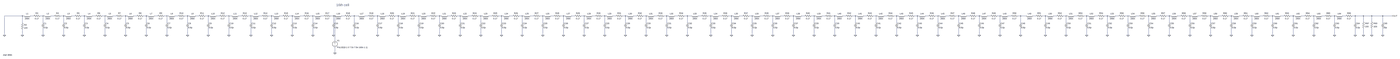
[diagram p0: schematic 64 cell_inject cell 16.asc, whole sheet]
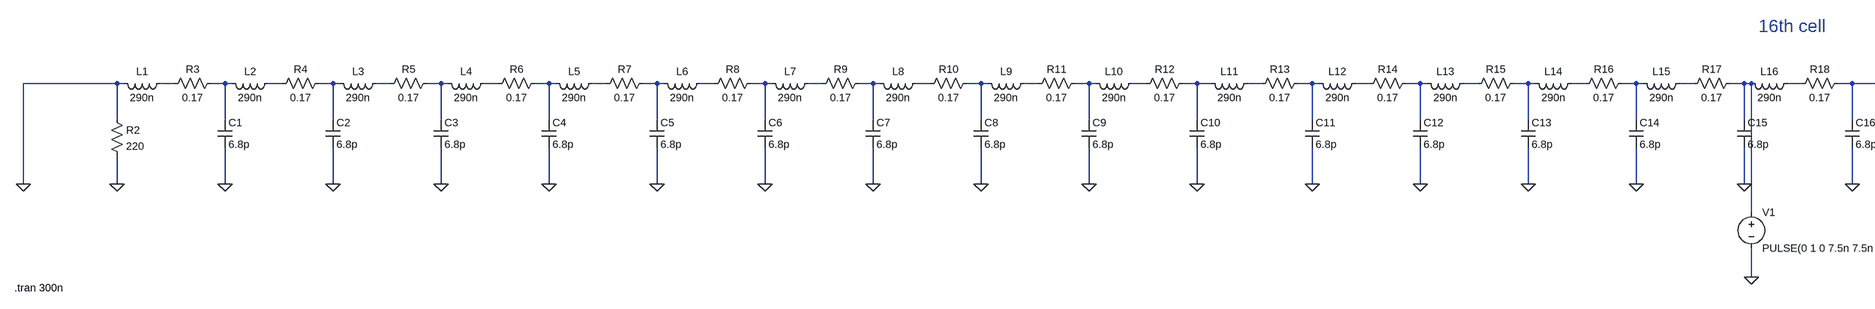
[diagram p1: schematic 64 cell_inject cell 16.asc, part, row 1 of 1, column 1 of 4]
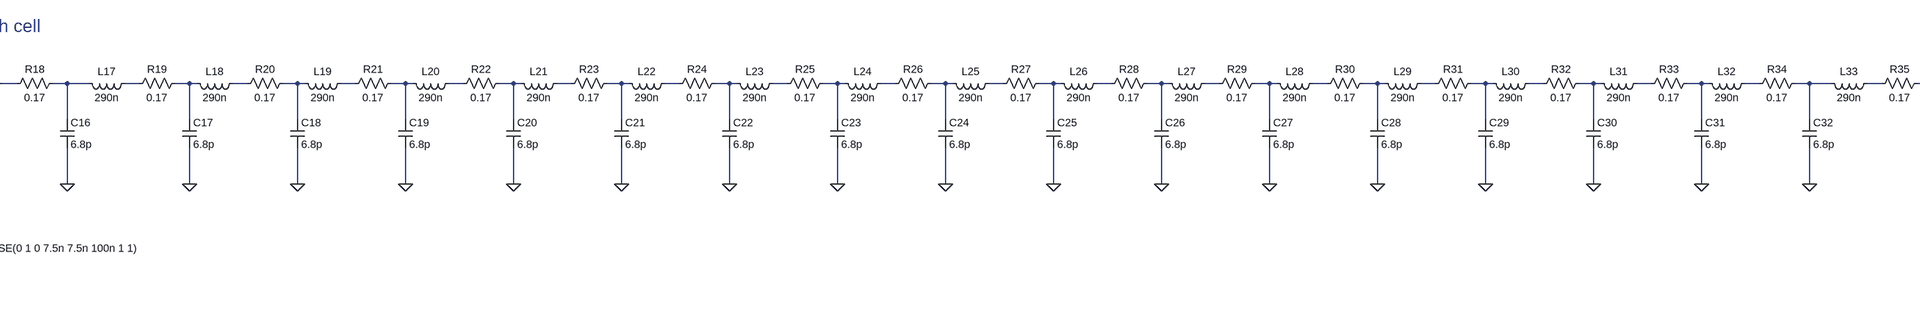
[diagram p2: schematic 64 cell_inject cell 16.asc, part, row 1 of 1, column 2 of 4]
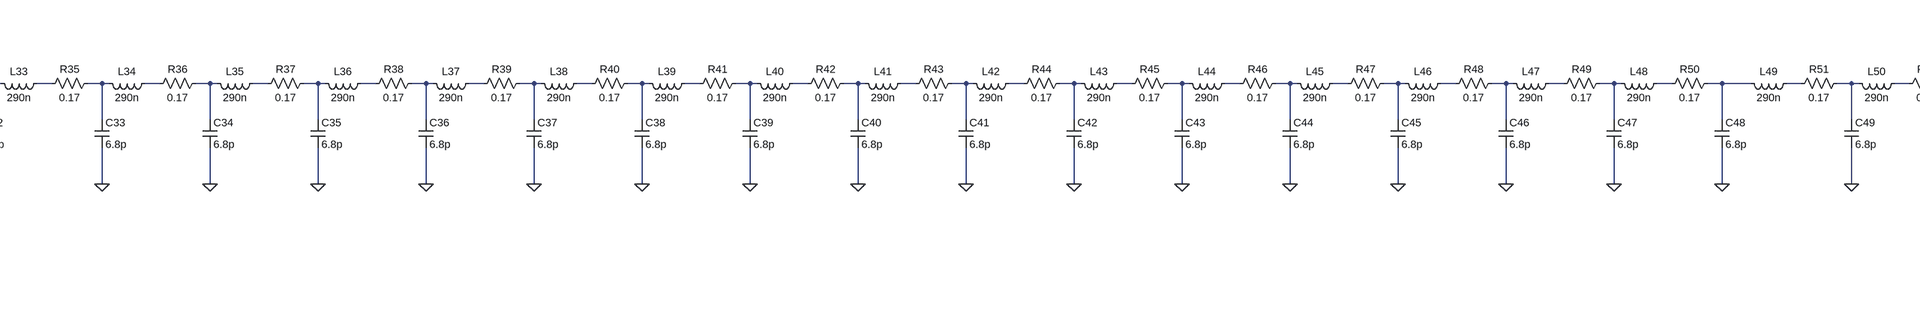
[diagram p3: schematic 64 cell_inject cell 16.asc, part, row 1 of 1, column 3 of 4]
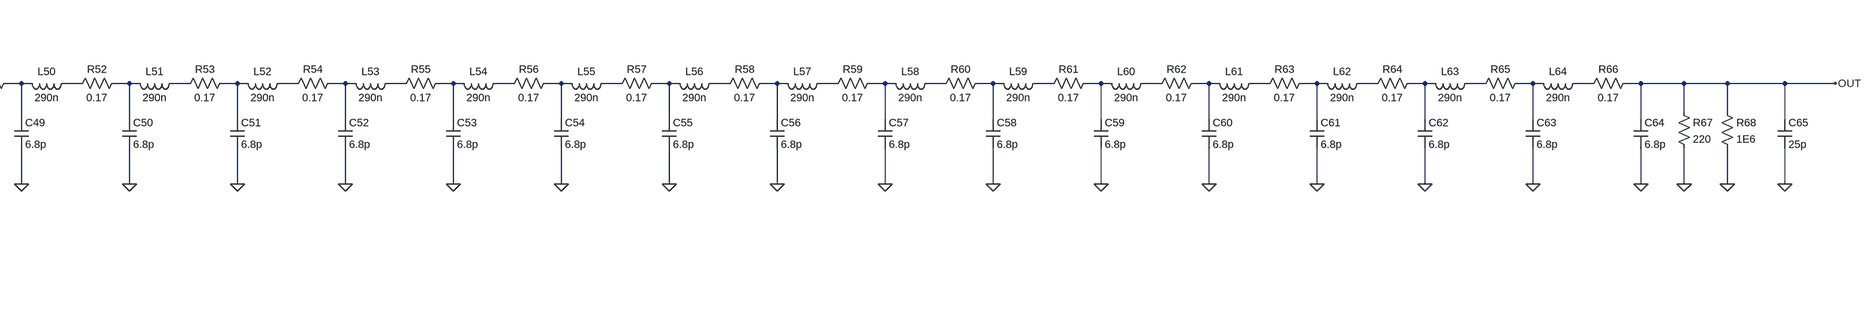
[diagram p4: schematic 64 cell_inject cell 16.asc, part, row 1 of 1, column 4 of 4]
64 cell_inject cell 16.asc, the LTspice schematic file:
Version 4
SHEET 1 8100 680
WIRE -7888 32 -8256 32
WIRE -7872 32 -7888 32
WIRE -7760 32 -7792 32
WIRE -7648 32 -7680 32
WIRE -7632 32 -7648 32
WIRE -7520 32 -7552 32
WIRE -7408 32 -7440 32
WIRE -7392 32 -7408 32
WIRE -7280 32 -7312 32
WIRE -7168 32 -7200 32
WIRE -7152 32 -7168 32
WIRE -7040 32 -7072 32
WIRE -6928 32 -6960 32
WIRE -6912 32 -6928 32
WIRE -6800 32 -6832 32
WIRE -6688 32 -6720 32
WIRE -6672 32 -6688 32
WIRE -6560 32 -6592 32
WIRE -6448 32 -6480 32
WIRE -6432 32 -6448 32
WIRE -6320 32 -6352 32
WIRE -6208 32 -6240 32
WIRE -6192 32 -6208 32
WIRE -6080 32 -6112 32
WIRE -5968 32 -6000 32
WIRE -5952 32 -5968 32
WIRE -5840 32 -5872 32
WIRE -5728 32 -5760 32
WIRE -5712 32 -5728 32
WIRE -5600 32 -5632 32
WIRE -5488 32 -5520 32
WIRE -5456 32 -5488 32
WIRE -5344 32 -5376 32
WIRE -5232 32 -5264 32
WIRE -5216 32 -5232 32
WIRE -5104 32 -5136 32
WIRE -4992 32 -5024 32
WIRE -4976 32 -4992 32
WIRE -4864 32 -4896 32
WIRE -4752 32 -4784 32
WIRE -4736 32 -4752 32
WIRE -4624 32 -4656 32
WIRE -4512 32 -4544 32
WIRE -4496 32 -4512 32
WIRE -4384 32 -4416 32
WIRE -4272 32 -4304 32
WIRE -4256 32 -4272 32
WIRE -4144 32 -4176 32
WIRE -4032 32 -4064 32
WIRE -3984 32 -4032 32
WIRE -3872 32 -3904 32
WIRE -3760 32 -3792 32
WIRE -3744 32 -3760 32
WIRE -3632 32 -3664 32
WIRE -3520 32 -3552 32
WIRE -3504 32 -3520 32
WIRE -3392 32 -3424 32
WIRE -3280 32 -3312 32
WIRE -3264 32 -3280 32
WIRE -3152 32 -3184 32
WIRE -3040 32 -3072 32
WIRE -3024 32 -3040 32
WIRE -2912 32 -2944 32
WIRE -2800 32 -2832 32
WIRE -2784 32 -2800 32
WIRE -2672 32 -2704 32
WIRE -2560 32 -2592 32
WIRE -2544 32 -2560 32
WIRE -2432 32 -2464 32
WIRE -2320 32 -2352 32
WIRE -2304 32 -2320 32
WIRE -2192 32 -2224 32
WIRE -2080 32 -2112 32
WIRE -2064 32 -2080 32
WIRE -1952 32 -1984 32
WIRE -1840 32 -1872 32
WIRE -1824 32 -1840 32
WIRE -1712 32 -1744 32
WIRE -1600 32 -1632 32
WIRE -1584 32 -1600 32
WIRE -1472 32 -1504 32
WIRE -1360 32 -1392 32
WIRE -1344 32 -1360 32
WIRE -1232 32 -1264 32
WIRE -1120 32 -1152 32
WIRE -1104 32 -1120 32
WIRE -992 32 -1024 32
WIRE -880 32 -912 32
WIRE -864 32 -880 32
WIRE -752 32 -784 32
WIRE -640 32 -672 32
WIRE -624 32 -640 32
WIRE -512 32 -544 32
WIRE -400 32 -432 32
WIRE -384 32 -400 32
WIRE -272 32 -304 32
WIRE -160 32 -192 32
WIRE -112 32 -160 32
WIRE 0 32 -32 32
WIRE 112 32 80 32
WIRE 128 32 112 32
WIRE 240 32 208 32
WIRE 352 32 320 32
WIRE 368 32 352 32
WIRE 480 32 448 32
WIRE 592 32 560 32
WIRE 608 32 592 32
WIRE 720 32 688 32
WIRE 832 32 800 32
WIRE 848 32 832 32
WIRE 960 32 928 32
WIRE 1072 32 1040 32
WIRE 1088 32 1072 32
WIRE 1200 32 1168 32
WIRE 1312 32 1280 32
WIRE 1328 32 1312 32
WIRE 1440 32 1408 32
WIRE 1552 32 1520 32
WIRE 1568 32 1552 32
WIRE 1680 32 1648 32
WIRE 1792 32 1760 32
WIRE 1808 32 1792 32
WIRE 1920 32 1888 32
WIRE 2032 32 2000 32
WIRE 2048 32 2032 32
WIRE 2160 32 2128 32
WIRE 2272 32 2240 32
WIRE 2288 32 2272 32
WIRE 2400 32 2368 32
WIRE 2512 32 2480 32
WIRE 2528 32 2512 32
WIRE 2640 32 2608 32
WIRE 2752 32 2720 32
WIRE 2768 32 2752 32
WIRE 2880 32 2848 32
WIRE 2992 32 2960 32
WIRE 3008 32 2992 32
WIRE 3120 32 3088 32
WIRE 3232 32 3200 32
WIRE 3248 32 3232 32
WIRE 3360 32 3328 32
WIRE 3472 32 3440 32
WIRE 3488 32 3472 32
WIRE 3600 32 3568 32
WIRE 3712 32 3680 32
WIRE 3776 32 3712 32
WIRE 3888 32 3856 32
WIRE 4000 32 3968 32
WIRE 4016 32 4000 32
WIRE 4128 32 4096 32
WIRE 4240 32 4208 32
WIRE 4256 32 4240 32
WIRE 4368 32 4336 32
WIRE 4480 32 4448 32
WIRE 4496 32 4480 32
WIRE 4608 32 4576 32
WIRE 4720 32 4688 32
WIRE 4736 32 4720 32
WIRE 4848 32 4816 32
WIRE 4960 32 4928 32
WIRE 4976 32 4960 32
WIRE 5088 32 5056 32
WIRE 5200 32 5168 32
WIRE 5216 32 5200 32
WIRE 5328 32 5296 32
WIRE 5440 32 5408 32
WIRE 5456 32 5440 32
WIRE 5568 32 5536 32
WIRE 5680 32 5648 32
WIRE 5696 32 5680 32
WIRE 5808 32 5776 32
WIRE 5920 32 5888 32
WIRE 5936 32 5920 32
WIRE 6048 32 6016 32
WIRE 6160 32 6128 32
WIRE 6176 32 6160 32
WIRE 6288 32 6256 32
WIRE 6400 32 6368 32
WIRE 6416 32 6400 32
WIRE 6528 32 6496 32
WIRE 6640 32 6608 32
WIRE 6656 32 6640 32
WIRE 6768 32 6736 32
WIRE 6880 32 6848 32
WIRE 6896 32 6880 32
WIRE 7008 32 6976 32
WIRE 7120 32 7088 32
WIRE 7136 32 7120 32
WIRE 7248 32 7216 32
WIRE 7360 32 7328 32
WIRE 7376 32 7360 32
WIRE 7488 32 7456 32
WIRE 7600 32 7568 32
WIRE 7696 32 7600 32
WIRE 7792 32 7696 32
WIRE 7920 32 7792 32
WIRE 8032 32 7920 32
WIRE 7696 96 7696 32
WIRE 7792 96 7792 32
WIRE -7888 112 -7888 32
WIRE -7648 112 -7648 32
WIRE -7408 112 -7408 32
WIRE -7168 112 -7168 32
WIRE -6928 112 -6928 32
WIRE -6688 112 -6688 32
WIRE -6448 112 -6448 32
WIRE -6208 112 -6208 32
WIRE -5968 112 -5968 32
WIRE -5728 112 -5728 32
WIRE -5488 112 -5488 32
WIRE -5232 112 -5232 32
WIRE -4992 112 -4992 32
WIRE -4752 112 -4752 32
WIRE -4512 112 -4512 32
WIRE -4272 112 -4272 32
WIRE -4032 112 -4032 32
WIRE -3760 112 -3760 32
WIRE -3520 112 -3520 32
WIRE -3280 112 -3280 32
WIRE -3040 112 -3040 32
WIRE -2800 112 -2800 32
WIRE -2560 112 -2560 32
WIRE -2320 112 -2320 32
WIRE -2080 112 -2080 32
WIRE -1840 112 -1840 32
WIRE -1600 112 -1600 32
WIRE -1360 112 -1360 32
WIRE -1120 112 -1120 32
WIRE -880 112 -880 32
WIRE -640 112 -640 32
WIRE -400 112 -400 32
WIRE -160 112 -160 32
WIRE 112 112 112 32
WIRE 352 112 352 32
WIRE 592 112 592 32
WIRE 832 112 832 32
WIRE 1072 112 1072 32
WIRE 1312 112 1312 32
WIRE 1552 112 1552 32
WIRE 1792 112 1792 32
WIRE 2032 112 2032 32
WIRE 2272 112 2272 32
WIRE 2512 112 2512 32
WIRE 2752 112 2752 32
WIRE 2992 112 2992 32
WIRE 3232 112 3232 32
WIRE 3472 112 3472 32
WIRE 3712 112 3712 32
WIRE 4000 112 4000 32
WIRE 4240 112 4240 32
WIRE 4480 112 4480 32
WIRE 4720 112 4720 32
WIRE 4960 112 4960 32
WIRE 5200 112 5200 32
WIRE 5440 112 5440 32
WIRE 5680 112 5680 32
WIRE 5920 112 5920 32
WIRE 6160 112 6160 32
WIRE 6400 112 6400 32
WIRE 6640 112 6640 32
WIRE 6880 112 6880 32
WIRE 7120 112 7120 32
WIRE 7360 112 7360 32
WIRE 7600 112 7600 32
WIRE 7920 112 7920 32
WIRE -8256 256 -8256 32
WIRE -7888 256 -7888 192
WIRE -7648 256 -7648 176
WIRE -7408 256 -7408 176
WIRE -7168 256 -7168 176
WIRE -6928 256 -6928 176
WIRE -6688 256 -6688 176
WIRE -6448 256 -6448 176
WIRE -6208 256 -6208 176
WIRE -5968 256 -5968 176
WIRE -5728 256 -5728 176
WIRE -5488 256 -5488 176
WIRE -5232 256 -5232 176
WIRE -4992 256 -4992 176
WIRE -4752 256 -4752 176
WIRE -4512 256 -4512 176
WIRE -4272 256 -4272 176
WIRE -4032 256 -4032 176
WIRE -3760 256 -3760 176
WIRE -3520 256 -3520 176
WIRE -3280 256 -3280 176
WIRE -3040 256 -3040 176
WIRE -2800 256 -2800 176
WIRE -2560 256 -2560 176
WIRE -2320 256 -2320 176
WIRE -2080 256 -2080 176
WIRE -1840 256 -1840 176
WIRE -1600 256 -1600 176
WIRE -1360 256 -1360 176
WIRE -1120 256 -1120 176
WIRE -880 256 -880 176
WIRE -640 256 -640 176
WIRE -400 256 -400 176
WIRE -160 256 -160 176
WIRE 112 256 112 176
WIRE 352 256 352 176
WIRE 592 256 592 176
WIRE 832 256 832 176
WIRE 1072 256 1072 176
WIRE 1312 256 1312 176
WIRE 1552 256 1552 176
WIRE 1792 256 1792 176
WIRE 2032 256 2032 176
WIRE 2272 256 2272 176
WIRE 2512 256 2512 176
WIRE 2752 256 2752 176
WIRE 2992 256 2992 176
WIRE 3232 256 3232 176
WIRE 3472 256 3472 176
WIRE 3712 256 3712 176
WIRE 4000 256 4000 176
WIRE 4240 256 4240 176
WIRE 4480 256 4480 176
WIRE 4720 256 4720 176
WIRE 4960 256 4960 176
WIRE 5200 256 5200 176
WIRE 5440 256 5440 176
WIRE 5680 256 5680 176
WIRE 5920 256 5920 176
WIRE 6160 256 6160 176
WIRE 6400 256 6400 176
WIRE 6640 256 6640 176
WIRE 6880 256 6880 176
WIRE 7120 256 7120 176
WIRE 7360 256 7360 176
WIRE 7600 256 7600 176
WIRE 7696 256 7696 176
WIRE 7792 256 7792 176
WIRE 7920 256 7920 176
WIRE -4256 320 -4256 32
WIRE -4256 464 -4256 400
FLAG -8256 256 0
FLAG -7888 256 0
FLAG -7648 256 0
FLAG -7408 256 0
FLAG -7168 256 0
FLAG -6928 256 0
FLAG -6688 256 0
FLAG -6448 256 0
FLAG -6208 256 0
FLAG -5968 256 0
FLAG -5728 256 0
FLAG -5488 256 0
FLAG -5232 256 0
FLAG -4992 256 0
FLAG -4752 256 0
FLAG -4512 256 0
FLAG -4272 256 0
FLAG -4032 256 0
FLAG -3760 256 0
FLAG -3520 256 0
FLAG -3280 256 0
FLAG -3040 256 0
FLAG -2800 256 0
FLAG -2560 256 0
FLAG -2320 256 0
FLAG -2080 256 0
FLAG -1840 256 0
FLAG -1600 256 0
FLAG -1360 256 0
FLAG -1120 256 0
FLAG -880 256 0
FLAG -640 256 0
FLAG -400 256 0
FLAG -160 256 0
FLAG 112 256 0
FLAG 352 256 0
FLAG 592 256 0
FLAG 832 256 0
FLAG 1072 256 0
FLAG 1312 256 0
FLAG 1552 256 0
FLAG 1792 256 0
FLAG 2032 256 0
FLAG 2272 256 0
FLAG 2512 256 0
FLAG 2752 256 0
FLAG 2992 256 0
FLAG 3232 256 0
FLAG 3472 256 0
FLAG 3712 256 0
FLAG 4000 256 0
FLAG 4240 256 0
FLAG 4480 256 0
FLAG 4720 256 0
FLAG 4960 256 0
FLAG 5200 256 0
FLAG 5440 256 0
FLAG 5680 256 0
FLAG 5920 256 0
FLAG 6160 256 0
FLAG 6400 256 0
FLAG 6640 256 0
FLAG 6880 256 0
FLAG 7120 256 0
FLAG 7360 256 0
FLAG 7600 256 0
FLAG 7696 256 0
FLAG 7792 256 0
FLAG 7920 256 0
FLAG 8032 32 OUT
FLAG -4256 464 0
SYMBOL res -7904 96 R0
SYMATTR InstName R2
SYMATTR Value 220
SYMBOL ind -7776 16 R90
WINDOW 0 5 56 VBottom 2
WINDOW 3 32 56 VTop 2
SYMATTR InstName L1
SYMATTR Value 290n
SYMBOL res -7664 16 R90
WINDOW 0 0 56 VBottom 2
WINDOW 3 32 56 VTop 2
SYMATTR InstName R3
SYMATTR Value 0.17
SYMBOL cap -7664 112 R0
SYMATTR InstName C1
SYMATTR Value 6.8p
SYMBOL ind -7536 16 R90
WINDOW 0 5 56 VBottom 2
WINDOW 3 32 56 VTop 2
SYMATTR InstName L2
SYMATTR Value 290n
SYMBOL res -7424 16 R90
WINDOW 0 0 56 VBottom 2
WINDOW 3 32 56 VTop 2
SYMATTR InstName R4
SYMATTR Value 0.17
SYMBOL cap -7424 112 R0
SYMATTR InstName C2
SYMATTR Value 6.8p
SYMBOL ind -7296 16 R90
WINDOW 0 5 56 VBottom 2
WINDOW 3 32 56 VTop 2
SYMATTR InstName L3
SYMATTR Value 290n
SYMBOL res -7184 16 R90
WINDOW 0 0 56 VBottom 2
WINDOW 3 32 56 VTop 2
SYMATTR InstName R5
SYMATTR Value 0.17
SYMBOL cap -7184 112 R0
SYMATTR InstName C3
SYMATTR Value 6.8p
SYMBOL ind -7056 16 R90
WINDOW 0 5 56 VBottom 2
WINDOW 3 32 56 VTop 2
SYMATTR InstName L4
SYMATTR Value 290n
SYMBOL res -6944 16 R90
WINDOW 0 0 56 VBottom 2
WINDOW 3 32 56 VTop 2
SYMATTR InstName R6
SYMATTR Value 0.17
SYMBOL cap -6944 112 R0
SYMATTR InstName C4
SYMATTR Value 6.8p
SYMBOL ind -6816 16 R90
WINDOW 0 5 56 VBottom 2
WINDOW 3 32 56 VTop 2
SYMATTR InstName L5
SYMATTR Value 290n
SYMBOL res -6704 16 R90
WINDOW 0 0 56 VBottom 2
WINDOW 3 32 56 VTop 2
SYMATTR InstName R7
SYMATTR Value 0.17
SYMBOL cap -6704 112 R0
SYMATTR InstName C5
SYMATTR Value 6.8p
SYMBOL ind -6576 16 R90
WINDOW 0 5 56 VBottom 2
WINDOW 3 32 56 VTop 2
SYMATTR InstName L6
SYMATTR Value 290n
SYMBOL res -6464 16 R90
WINDOW 0 0 56 VBottom 2
WINDOW 3 32 56 VTop 2
SYMATTR InstName R8
SYMATTR Value 0.17
SYMBOL cap -6464 112 R0
SYMATTR InstName C6
SYMATTR Value 6.8p
SYMBOL ind -6336 16 R90
WINDOW 0 5 56 VBottom 2
WINDOW 3 32 56 VTop 2
SYMATTR InstName L7
SYMATTR Value 290n
SYMBOL res -6224 16 R90
WINDOW 0 0 56 VBottom 2
WINDOW 3 32 56 VTop 2
SYMATTR InstName R9
SYMATTR Value 0.17
SYMBOL cap -6224 112 R0
SYMATTR InstName C7
SYMATTR Value 6.8p
SYMBOL ind -6096 16 R90
WINDOW 0 5 56 VBottom 2
WINDOW 3 32 56 VTop 2
SYMATTR InstName L8
SYMATTR Value 290n
SYMBOL res -5984 16 R90
WINDOW 0 0 56 VBottom 2
WINDOW 3 32 56 VTop 2
SYMATTR InstName R10
SYMATTR Value 0.17
SYMBOL cap -5984 112 R0
SYMATTR InstName C8
SYMATTR Value 6.8p
SYMBOL ind -5856 16 R90
WINDOW 0 5 56 VBottom 2
WINDOW 3 32 56 VTop 2
SYMATTR InstName L9
SYMATTR Value 290n
SYMBOL res -5744 16 R90
WINDOW 0 0 56 VBottom 2
WINDOW 3 32 56 VTop 2
SYMATTR InstName R11
SYMATTR Value 0.17
SYMBOL cap -5744 112 R0
SYMATTR InstName C9
SYMATTR Value 6.8p
SYMBOL ind -5616 16 R90
WINDOW 0 5 56 VBottom 2
WINDOW 3 32 56 VTop 2
SYMATTR InstName L10
SYMATTR Value 290n
SYMBOL res -5504 16 R90
WINDOW 0 0 56 VBottom 2
WINDOW 3 32 56 VTop 2
SYMATTR InstName R12
SYMATTR Value 0.17
SYMBOL cap -5504 112 R0
SYMATTR InstName C10
SYMATTR Value 6.8p
SYMBOL ind -5360 16 R90
WINDOW 0 5 56 VBottom 2
WINDOW 3 32 56 VTop 2
SYMATTR InstName L11
SYMATTR Value 290n
SYMBOL res -5248 16 R90
WINDOW 0 0 56 VBottom 2
WINDOW 3 32 56 VTop 2
SYMATTR InstName R13
SYMATTR Value 0.17
SYMBOL cap -5248 112 R0
SYMATTR InstName C11
SYMATTR Value 6.8p
SYMBOL ind -5120 16 R90
WINDOW 0 5 56 VBottom 2
WINDOW 3 32 56 VTop 2
SYMATTR InstName L12
SYMATTR Value 290n
SYMBOL res -5008 16 R90
WINDOW 0 0 56 VBottom 2
WINDOW 3 32 56 VTop 2
SYMATTR InstName R14
SYMATTR Value 0.17
SYMBOL cap -5008 112 R0
SYMATTR InstName C12
SYMATTR Value 6.8p
SYMBOL ind -4880 16 R90
WINDOW 0 5 56 VBottom 2
WINDOW 3 32 56 VTop 2
SYMATTR InstName L13
SYMATTR Value 290n
SYMBOL res -4768 16 R90
WINDOW 0 0 56 VBottom 2
WINDOW 3 32 56 VTop 2
SYMATTR InstName R15
SYMATTR Value 0.17
SYMBOL cap -4768 112 R0
SYMATTR InstName C13
SYMATTR Value 6.8p
SYMBOL ind -4640 16 R90
WINDOW 0 5 56 VBottom 2
WINDOW 3 32 56 VTop 2
SYMATTR InstName L14
SYMATTR Value 290n
SYMBOL res -4528 16 R90
WINDOW 0 0 56 VBottom 2
WINDOW 3 32 56 VTop 2
SYMATTR InstName R16
SYMATTR Value 0.17
SYMBOL cap -4528 112 R0
SYMATTR InstName C14
SYMATTR Value 6.8p
SYMBOL ind -4400 16 R90
WINDOW 0 5 56 VBottom 2
WINDOW 3 32 56 VTop 2
SYMATTR InstName L15
SYMATTR Value 290n
SYMBOL res -4288 16 R90
WINDOW 0 0 56 VBottom 2
WINDOW 3 32 56 VTop 2
SYMATTR InstName R17
SYMATTR Value 0.17
SYMBOL cap -4288 112 R0
SYMATTR InstName C15
SYMATTR Value 6.8p
SYMBOL ind -4160 16 R90
WINDOW 0 5 56 VBottom 2
WINDOW 3 32 56 VTop 2
SYMATTR InstName L16
SYMATTR Value 290n
SYMBOL res -4048 16 R90
WINDOW 0 0 56 VBottom 2
WINDOW 3 32 56 VTop 2
SYMATTR InstName R18
SYMATTR Value 0.17
SYMBOL cap -4048 112 R0
SYMATTR InstName C16
SYMATTR Value 6.8p
SYMBOL ind -3888 16 R90
WINDOW 0 5 56 VBottom 2
WINDOW 3 32 56 VTop 2
SYMATTR InstName L17
SYMATTR Value 290n
SYMBOL res -3776 16 R90
WINDOW 0 0 56 VBottom 2
WINDOW 3 32 56 VTop 2
SYMATTR InstName R19
SYMATTR Value 0.17
SYMBOL cap -3776 112 R0
SYMATTR InstName C17
SYMATTR Value 6.8p
SYMBOL ind -3648 16 R90
WINDOW 0 5 56 VBottom 2
WINDOW 3 32 56 VTop 2
SYMATTR InstName L18
SYMATTR Value 290n
SYMBOL res -3536 16 R90
WINDOW 0 0 56 VBottom 2
WINDOW 3 32 56 VTop 2
SYMATTR InstName R20
SYMATTR Value 0.17
SYMBOL cap -3536 112 R0
SYMATTR InstName C18
SYMATTR Value 6.8p
SYMBOL ind -3408 16 R90
WINDOW 0 5 56 VBottom 2
WINDOW 3 32 56 VTop 2
SYMATTR InstName L19
SYMATTR Value 290n
SYMBOL res -3296 16 R90
WINDOW 0 0 56 VBottom 2
WINDOW 3 32 56 VTop 2
SYMATTR InstName R21
SYMATTR Value 0.17
SYMBOL cap -3296 112 R0
SYMATTR InstName C19
SYMATTR Value 6.8p
SYMBOL ind -3168 16 R90
WINDOW 0 5 56 VBottom 2
WINDOW 3 32 56 VTop 2
SYMATTR InstName L20
SYMATTR Value 290n
SYMBOL res -3056 16 R90
WINDOW 0 0 56 VBottom 2
WINDOW 3 32 56 VTop 2
SYMATTR InstName R22
SYMATTR Value 0.17
SYMBOL cap -3056 112 R0
SYMATTR InstName C20
SYMATTR Value 6.8p
SYMBOL ind -2928 16 R90
WINDOW 0 5 56 VBottom 2
WINDOW 3 32 56 VTop 2
SYMATTR InstName L21
SYMATTR Value 290n
SYMBOL res -2816 16 R90
WINDOW 0 0 56 VBottom 2
WINDOW 3 32 56 VTop 2
SYMATTR InstName R23
SYMATTR Value 0.17
SYMBOL cap -2816 112 R0
SYMATTR InstName C21
SYMATTR Value 6.8p
SYMBOL ind -2688 16 R90
WINDOW 0 5 56 VBottom 2
WINDOW 3 32 56 VTop 2
SYMATTR InstName L22
SYMATTR Value 290n
SYMBOL res -2576 16 R90
WINDOW 0 0 56 VBottom 2
WINDOW 3 32 56 VTop 2
SYMATTR InstName R24
SYMATTR Value 0.17
SYMBOL cap -2576 112 R0
SYMATTR InstName C22
SYMATTR Value 6.8p
SYMBOL ind -2448 16 R90
WINDOW 0 5 56 VBottom 2
WINDOW 3 32 56 VTop 2
SYMATTR InstName L23
SYMATTR Value 290n
SYMBOL res -2336 16 R90
WINDOW 0 0 56 VBottom 2
WINDOW 3 32 56 VTop 2
SYMATTR InstName R25
SYMATTR Value 0.17
SYMBOL cap -2336 112 R0
SYMATTR InstName C23
SYMATTR Value 6.8p
SYMBOL ind -2208 16 R90
WINDOW 0 5 56 VBottom 2
WINDOW 3 32 56 VTop 2
SYMATTR InstName L24
SYMATTR Value 290n
SYMBOL res -2096 16 R90
WINDOW 0 0 56 VBottom 2
WINDOW 3 32 56 VTop 2
SYMATTR InstName R26
SYMATTR Value 0.17
SYMBOL cap -2096 112 R0
SYMATTR InstName C24
SYMATTR Value 6.8p
SYMBOL ind -1968 16 R90
WINDOW 0 5 56 VBottom 2
WINDOW 3 32 56 VTop 2
SYMATTR InstName L25
SYMATTR Value 290n
SYMBOL res -1856 16 R90
WINDOW 0 0 56 VBottom 2
WINDOW 3 32 56 VTop 2
SYMATTR InstName R27
SYMATTR Value 0.17
SYMBOL cap -1856 112 R0
SYMATTR InstName C25
SYMATTR Value 6.8p
SYMBOL ind -1728 16 R90
WINDOW 0 5 56 VBottom 2
WINDOW 3 32 56 VTop 2
SYMATTR InstName L26
SYMATTR Value 290n
SYMBOL res -1616 16 R90
WINDOW 0 0 56 VBottom 2
WINDOW 3 32 56 VTop 2
SYMATTR InstName R28
SYMATTR Value 0.17
SYMBOL cap -1616 112 R0
SYMATTR InstName C26
SYMATTR Value 6.8p
SYMBOL ind -1488 16 R90
WINDOW 0 5 56 VBottom 2
WINDOW 3 32 56 VTop 2
SYMATTR InstName L27
SYMATTR Value 290n
SYMBOL res -1376 16 R90
WINDOW 0 0 56 VBottom 2
WINDOW 3 32 56 VTop 2
SYMATTR InstName R29
SYMATTR Value 0.17
SYMBOL cap -1376 112 R0
SYMATTR InstName C27
SYMATTR Value 6.8p
SYMBOL ind -1248 16 R90
WINDOW 0 5 56 VBottom 2
WINDOW 3 32 56 VTop 2
SYMATTR InstName L28
SYMATTR Value 290n
SYMBOL res -1136 16 R90
WINDOW 0 0 56 VBottom 2
WINDOW 3 32 56 VTop 2
SYMATTR InstName R30
SYMATTR Value 0.17
SYMBOL cap -1136 112 R0
SYMATTR InstName C28
SYMATTR Value 6.8p
SYMBOL ind -1008 16 R90
WINDOW 0 5 56 VBottom 2
WINDOW 3 32 56 VTop 2
SYMATTR InstName L29
SYMATTR Value 290n
SYMBOL res -896 16 R90
WINDOW 0 0 56 VBottom 2
WINDOW 3 32 56 VTop 2
SYMATTR InstName R31
SYMATTR Value 0.17
SYMBOL cap -896 112 R0
SYMATTR InstName C29
SYMATTR Value 6.8p
SYMBOL ind -768 16 R90
WINDOW 0 5 56 VBottom 2
WINDOW 3 32 56 VTop 2
SYMATTR InstName L30
SYMATTR Value 290n
SYMBOL res -656 16 R90
WINDOW 0 0 56 VBottom 2
WINDOW 3 32 56 VTop 2
SYMATTR InstName R32
SYMATTR Value 0.17
SYMBOL cap -656 112 R0
SYMATTR InstName C30
SYMATTR Value 6.8p
SYMBOL ind -528 16 R90
WINDOW 0 5 56 VBottom 2
WINDOW 3 32 56 VTop 2
SYMATTR InstName L31
SYMATTR Value 290n
SYMBOL res -416 16 R90
WINDOW 0 0 56 VBottom 2
WINDOW 3 32 56 VTop 2
SYMATTR InstName R33
SYMATTR Value 0.17
SYMBOL cap -416 112 R0
SYMATTR InstName C31
SYMATTR Value 6.8p
SYMBOL ind -288 16 R90
WINDOW 0 5 56 VBottom 2
WINDOW 3 32 56 VTop 2
SYMATTR InstName L32
SYMATTR Value 290n
SYMBOL res -176 16 R90
WINDOW 0 0 56 VBottom 2
WINDOW 3 32 56 VTop 2
SYMATTR InstName R34
SYMATTR Value 0.17
SYMBOL cap -176 112 R0
SYMATTR InstName C32
SYMATTR Value 6.8p
SYMBOL ind -16 16 R90
WINDOW 0 5 56 VBottom 2
WINDOW 3 32 56 VTop 2
SYMATTR InstName L33
SYMATTR Value 290n
SYMBOL res 96 16 R90
WINDOW 0 0 56 VBottom 2
WINDOW 3 32 56 VTop 2
SYMATTR InstName R35
SYMATTR Value 0.17
SYMBOL cap 96 112 R0
SYMATTR InstName C33
SYMATTR Value 6.8p
SYMBOL ind 224 16 R90
WINDOW 0 5 56 VBottom 2
WINDOW 3 32 56 VTop 2
SYMATTR InstName L34
SYMATTR Value 290n
SYMBOL res 336 16 R90
WINDOW 0 0 56 VBottom 2
WINDOW 3 32 56 VTop 2
SYMATTR InstName R36
SYMATTR Value 0.17
SYMBOL cap 336 112 R0
SYMATTR InstName C34
SYMATTR Value 6.8p
SYMBOL ind 464 16 R90
WINDOW 0 5 56 VBottom 2
WINDOW 3 32 56 VTop 2
SYMATTR InstName L35
SYMATTR Value 290n
SYMBOL res 576 16 R90
WINDOW 0 0 56 VBottom 2
WINDOW 3 32 56 VTop 2
SYMATTR InstName R37
SYMATTR Value 0.17
SYMBOL cap 576 112 R0
SYMATTR InstName C35
SYMATTR Value 6.8p
SYMBOL ind 704 16 R90
WINDOW 0 5 56 VBottom 2
WINDOW 3 32 56 VTop 2
SYMATTR InstName L36
SYMATTR Value 290n
SYMBOL res 816 16 R90
WINDOW 0 0 56 VBottom 2
WINDOW 3 32 56 VTop 2
SYMATTR InstName R38
SYMATTR Value 0.17
SYMBOL cap 816 112 R0
SYMATTR InstName C36
SYMATTR Value 6.8p
SYMBOL ind 944 16 R90
WINDOW 0 5 56 VBottom 2
WINDOW 3 32 56 VTop 2
SYMATTR InstName L37
SYMATTR Value 290n
SYMBOL res 1056 16 R90
WINDOW 0 0 56 VBottom 2
WINDOW 3 32 56 VTop 2
SYMATTR InstName R39
SYMATTR Value 0.17
SYMBOL cap 1056 112 R0
SYMATTR InstName C37
SYMATTR Value 6.8p
SYMBOL ind 1184 16 R90
WINDOW 0 5 56 VBottom 2
WINDOW 3 32 56 VTop 2
SYMATTR InstName L38
SYMATTR Value 290n
SYMBOL res 1296 16 R90
WINDOW 0 0 56 VBottom 2
WINDOW 3 32 56 VTop 2
SYMATTR InstName R40
SYMATTR Value 0.17
SYMBOL cap 1296 112 R0
SYMATTR InstName C38
SYMATTR Value 6.8p
SYMBOL ind 1424 16 R90
WINDOW 0 5 56 VBottom 2
WINDOW 3 32 56 VTop 2
SYMATTR InstName L39
SYMATTR Value 290n
SYMBOL res 1536 16 R90
WINDOW 0 0 56 VBottom 2
WINDOW 3 32 56 VTop 2
SYMATTR InstName R41
SYMATTR Value 0.17
SYMBOL cap 1536 112 R0
SYMATTR InstName C39
SYMATTR Value 6.8p
SYMBOL ind 1664 16 R90
WINDOW 0 5 56 VBottom 2
WINDOW 3 32 56 VTop 2
SYMATTR InstName L40
SYMATTR Value 290n
SYMBOL res 1776 16 R90
WINDOW 0 0 56 VBottom 2
WINDOW 3 32 56 VTop 2
SYMATTR InstName R42
SYMATTR Value 0.17
SYMBOL cap 1776 112 R0
SYMATTR InstName C40
SYMATTR Value 6.8p
SYMBOL ind 1904 16 R90
WINDOW 0 5 56 VBottom 2
WINDOW 3 32 56 VTop 2
SYMATTR InstName L41
SYMATTR Value 290n
SYMBOL res 2016 16 R90
WINDOW 0 0 56 VBottom 2
WINDOW 3 32 56 VTop 2
SYMATTR InstName R43
SYMATTR Value 0.17
SYMBOL cap 2016 112 R0
SYMATTR InstName C41
SYMATTR Value 6.8p
SYMBOL ind 2144 16 R90
WINDOW 0 5 56 VBottom 2
WINDOW 3 32 56 VTop 2
SYMATTR InstName L42
SYMATTR Value 290n
SYMBOL res 2256 16 R90
WINDOW 0 0 56 VBottom 2
WINDOW 3 32 56 VTop 2
SYMATTR InstName R44
SYMATTR Value 0.17
SYMBOL cap 2256 112 R0
SYMATTR InstName C42
SYMATTR Value 6.8p
SYMBOL ind 2384 16 R90
WINDOW 0 5 56 VBottom 2
WINDOW 3 32 56 VTop 2
SYMATTR InstName L43
SYMATTR Value 290n
SYMBOL res 2496 16 R90
WINDOW 0 0 56 VBottom 2
WINDOW 3 32 56 VTop 2
SYMATTR InstName R45
SYMATTR Value 0.17
SYMBOL cap 2496 112 R0
SYMATTR InstName C43
SYMATTR Value 6.8p
SYMBOL ind 2624 16 R90
WINDOW 0 5 56 VBottom 2
WINDOW 3 32 56 VTop 2
SYMATTR InstName L44
SYMATTR Value 290n
SYMBOL res 2736 16 R90
WINDOW 0 0 56 VBottom 2
WINDOW 3 32 56 VTop 2
SYMATTR InstName R46
SYMATTR Value 0.17
SYMBOL cap 2736 112 R0
SYMATTR InstName C44
SYMATTR Value 6.8p
SYMBOL ind 2864 16 R90
WINDOW 0 5 56 VBottom 2
WINDOW 3 32 56 VTop 2
SYMATTR InstName L45
SYMATTR Value 290n
SYMBOL res 2976 16 R90
WINDOW 0 0 56 VBottom 2
WINDOW 3 32 56 VTop 2
SYMATTR InstName R47
SYMATTR Value 0.17
SYMBOL cap 2976 112 R0
SYMATTR InstName C45
SYMATTR Value 6.8p
SYMBOL ind 3104 16 R90
WINDOW 0 5 56 VBottom 2
WINDOW 3 32 56 VTop 2
SYMATTR InstName L46
SYMATTR Value 290n
SYMBOL res 3216 16 R90
WINDOW 0 0 56 VBottom 2
WINDOW 3 32 56 VTop 2
SYMATTR InstName R48
SYMATTR Value 0.17
SYMBOL cap 3216 112 R0
SYMATTR InstName C46
SYMATTR Value 6.8p
SYMBOL ind 3344 16 R90
WINDOW 0 5 56 VBottom 2
WINDOW 3 32 56 VTop 2
SYMATTR InstName L47
SYMATTR Value 290n
SYMBOL res 3456 16 R90
WINDOW 0 0 56 VBottom 2
WINDOW 3 32 56 VTop 2
SYMATTR InstName R49
SYMATTR Value 0.17
SYMBOL cap 3456 112 R0
SYMATTR InstName C47
SYMATTR Value 6.8p
SYMBOL ind 3584 16 R90
WINDOW 0 5 56 VBottom 2
WINDOW 3 32 56 VTop 2
SYMATTR InstName L48
SYMATTR Value 290n
SYMBOL res 3696 16 R90
WINDOW 0 0 56 VBottom 2
WINDOW 3 32 56 VTop 2
SYMATTR InstName R50
SYMATTR Value 0.17
SYMBOL cap 3696 112 R0
SYMATTR InstName C48
SYMATTR Value 6.8p
SYMBOL ind 3872 16 R90
WINDOW 0 5 56 VBottom 2
WINDOW 3 32 56 VTop 2
SYMATTR InstName L49
SYMATTR Value 290n
SYMBOL res 3984 16 R90
WINDOW 0 0 56 VBottom 2
WINDOW 3 32 56 VTop 2
SYMATTR InstName R51
SYMATTR Value 0.17
SYMBOL cap 3984 112 R0
SYMATTR InstName C49
SYMATTR Value 6.8p
SYMBOL ind 4112 16 R90
WINDOW 0 5 56 VBottom 2
WINDOW 3 32 56 VTop 2
SYMATTR InstName L50
SYMATTR Value 290n
SYMBOL res 4224 16 R90
WINDOW 0 0 56 VBottom 2
WINDOW 3 32 56 VTop 2
SYMATTR InstName R52
SYMATTR Value 0.17
SYMBOL cap 4224 112 R0
SYMATTR InstName C50
SYMATTR Value 6.8p
SYMBOL ind 4352 16 R90
WINDOW 0 5 56 VBottom 2
WINDOW 3 32 56 VTop 2
SYMATTR InstName L51
SYMATTR Value 290n
SYMBOL res 4464 16 R90
WINDOW 0 0 56 VBottom 2
WINDOW 3 32 56 VTop 2
SYMATTR InstName R53
SYMATTR Value 0.17
SYMBOL cap 4464 112 R0
SYMATTR InstName C51
SYMATTR Value 6.8p
SYMBOL ind 4592 16 R90
WINDOW 0 5 56 VBottom 2
WINDOW 3 32 56 VTop 2
SYMATTR InstName L52
SYMATTR Value 290n
SYMBOL res 4704 16 R90
WINDOW 0 0 56 VBottom 2
WINDOW 3 32 56 VTop 2
SYMATTR InstName R54
SYMATTR Value 0.17
SYMBOL cap 4704 112 R0
SYMATTR InstName C52
SYMATTR Value 6.8p
SYMBOL ind 4832 16 R90
WINDOW 0 5 56 VBottom 2
WINDOW 3 32 56 VTop 2
SYMATTR InstName L53
SYMATTR Value 290n
SYMBOL res 4944 16 R90
WINDOW 0 0 56 VBottom 2
WINDOW 3 32 56 VTop 2
SYMATTR InstName R55
SYMATTR Value 0.17
SYMBOL cap 4944 112 R0
SYMATTR InstName C53
SYMATTR Value 6.8p
SYMBOL ind 5072 16 R90
WINDOW 0 5 56 VBottom 2
WINDOW 3 32 56 VTop 2
SYMATTR InstName L54
SYMATTR Value 290n
SYMBOL res 5184 16 R90
WINDOW 0 0 56 VBottom 2
WINDOW 3 32 56 VTop 2
SYMATTR InstName R56
SYMATTR Value 0.17
SYMBOL cap 5184 112 R0
SYMATTR InstName C54
SYMATTR Value 6.8p
SYMBOL ind 5312 16 R90
WINDOW 0 5 56 VBottom 2
WINDOW 3 32 56 VTop 2
SYMATTR InstName L55
SYMATTR Value 290n
SYMBOL res 5424 16 R90
WINDOW 0 0 56 VBottom 2
WINDOW 3 32 56 VTop 2
SYMATTR InstName R57
SYMATTR Value 0.17
SYMBOL cap 5424 112 R0
SYMATTR InstName C55
SYMATTR Value 6.8p
SYMBOL ind 5552 16 R90
WINDOW 0 5 56 VBottom 2
WINDOW 3 32 56 VTop 2
SYMATTR InstName L56
SYMATTR Value 290n
SYMBOL res 5664 16 R90
WINDOW 0 0 56 VBottom 2
WINDOW 3 32 56 VTop 2
SYMATTR InstName R58
SYMATTR Value 0.17
SYMBOL cap 5664 112 R0
SYMATTR InstName C56
SYMATTR Value 6.8p
SYMBOL ind 5792 16 R90
WINDOW 0 5 56 VBottom 2
WINDOW 3 32 56 VTop 2
SYMATTR InstName L57
SYMATTR Value 290n
SYMBOL res 5904 16 R90
WINDOW 0 0 56 VBottom 2
WINDOW 3 32 56 VTop 2
SYMATTR InstName R59
SYMATTR Value 0.17
SYMBOL cap 5904 112 R0
SYMATTR InstName C57
SYMATTR Value 6.8p
SYMBOL ind 6032 16 R90
WINDOW 0 5 56 VBottom 2
WINDOW 3 32 56 VTop 2
SYMATTR InstName L58
SYMATTR Value 290n
SYMBOL res 6144 16 R90
WINDOW 0 0 56 VBottom 2
WINDOW 3 32 56 VTop 2
SYMATTR InstName R60
SYMATTR Value 0.17
SYMBOL cap 6144 112 R0
SYMATTR InstName C58
SYMATTR Value 6.8p
SYMBOL ind 6272 16 R90
WINDOW 0 5 56 VBottom 2
WINDOW 3 32 56 VTop 2
SYMATTR InstName L59
SYMATTR Value 290n
SYMBOL res 6384 16 R90
WINDOW 0 0 56 VBottom 2
WINDOW 3 32 56 VTop 2
SYMATTR InstName R61
SYMATTR Value 0.17
SYMBOL cap 6384 112 R0
SYMATTR InstName C59
SYMATTR Value 6.8p
SYMBOL ind 6512 16 R90
WINDOW 0 5 56 VBottom 2
WINDOW 3 32 56 VTop 2
SYMATTR InstName L60
SYMATTR Value 290n
SYMBOL res 6624 16 R90
WINDOW 0 0 56 VBottom 2
WINDOW 3 32 56 VTop 2
SYMATTR InstName R62
SYMATTR Value 0.17
SYMBOL cap 6624 112 R0
SYMATTR InstName C60
SYMATTR Value 6.8p
SYMBOL ind 6752 16 R90
WINDOW 0 5 56 VBottom 2
WINDOW 3 32 56 VTop 2
SYMATTR InstName L61
SYMATTR Value 290n
SYMBOL res 6864 16 R90
WINDOW 0 0 56 VBottom 2
WINDOW 3 32 56 VTop 2
SYMATTR InstName R63
SYMATTR Value 0.17
SYMBOL cap 6864 112 R0
SYMATTR InstName C61
SYMATTR Value 6.8p
SYMBOL ind 6992 16 R90
WINDOW 0 5 56 VBottom 2
WINDOW 3 32 56 VTop 2
SYMATTR InstName L62
SYMATTR Value 290n
SYMBOL res 7104 16 R90
WINDOW 0 0 56 VBottom 2
WINDOW 3 32 56 VTop 2
SYMATTR InstName R64
SYMATTR Value 0.17
SYMBOL cap 7104 112 R0
SYMATTR InstName C62
SYMATTR Value 6.8p
SYMBOL ind 7232 16 R90
WINDOW 0 5 56 VBottom 2
WINDOW 3 32 56 VTop 2
SYMATTR InstName L63
SYMATTR Value 290n
SYMBOL res 7344 16 R90
WINDOW 0 0 56 VBottom 2
WINDOW 3 32 56 VTop 2
SYMATTR InstName R65
SYMATTR Value 0.17
SYMBOL cap 7344 112 R0
SYMATTR InstName C63
SYMATTR Value 6.8p
SYMBOL ind 7472 16 R90
WINDOW 0 5 56 VBottom 2
WINDOW 3 32 56 VTop 2
SYMATTR InstName L64
SYMATTR Value 290n
SYMBOL res 7584 16 R90
WINDOW 0 0 56 VBottom 2
WINDOW 3 32 56 VTop 2
SYMATTR InstName R66
SYMATTR Value 0.17
SYMBOL cap 7584 112 R0
SYMATTR InstName C64
SYMATTR Value 6.8p
SYMBOL res 7680 80 R0
SYMATTR InstName R67
SYMATTR Value 220
SYMBOL res 7776 80 R0
SYMATTR InstName R68
SYMATTR Value 1E6
SYMBOL cap 7904 112 R0
SYMATTR InstName C65
SYMATTR Value 25p
SYMBOL voltage -4256 304 R0
WINDOW 123 0 0 Left 0
WINDOW 39 0 0 Left 0
SYMATTR InstName V1
SYMATTR Value PULSE(0 1 0 7.5n 7.5n 100n 1 1)
TEXT -4240 -96 Left 4 ;16th cell
TEXT -8276 488 Left 2 !.tran 300n

The netlist it stands for:
* 64 cell_inject cell 16.asc
R2 0 0 220
L1 N001 0 290n
R3 N002 N001 0.17
C1 N002 0 6.8p
L2 N003 N002 290n
R4 N004 N003 0.17
C2 N004 0 6.8p
L3 N005 N004 290n
R5 N006 N005 0.17
C3 N006 0 6.8p
L4 N007 N006 290n
R6 N008 N007 0.17
C4 N008 0 6.8p
L5 N009 N008 290n
R7 N010 N009 0.17
C5 N010 0 6.8p
L6 N011 N010 290n
R8 N012 N011 0.17
C6 N012 0 6.8p
L7 N013 N012 290n
R9 N014 N013 0.17
C7 N014 0 6.8p
L8 N015 N014 290n
R10 N016 N015 0.17
C8 N016 0 6.8p
L9 N017 N016 290n
R11 N018 N017 0.17
C9 N018 0 6.8p
L10 N019 N018 290n
R12 N020 N019 0.17
C10 N020 0 6.8p
L11 N021 N020 290n
R13 N022 N021 0.17
C11 N022 0 6.8p
L12 N023 N022 290n
R14 N024 N023 0.17
C12 N024 0 6.8p
L13 N025 N024 290n
R15 N026 N025 0.17
C13 N026 0 6.8p
L14 N027 N026 290n
R16 N028 N027 0.17
C14 N028 0 6.8p
L15 N029 N028 290n
R17 N030 N029 0.17
C15 N030 0 6.8p
L16 N031 N030 290n
R18 N032 N031 0.17
C16 N032 0 6.8p
L17 N033 N032 290n
R19 N034 N033 0.17
C17 N034 0 6.8p
L18 N035 N034 290n
R20 N036 N035 0.17
C18 N036 0 6.8p
L19 N037 N036 290n
R21 N038 N037 0.17
C19 N038 0 6.8p
L20 N039 N038 290n
R22 N040 N039 0.17
C20 N040 0 6.8p
L21 N041 N040 290n
R23 N042 N041 0.17
C21 N042 0 6.8p
L22 N043 N042 290n
R24 N044 N043 0.17
C22 N044 0 6.8p
L23 N045 N044 290n
R25 N046 N045 0.17
C23 N046 0 6.8p
L24 N047 N046 290n
R26 N048 N047 0.17
C24 N048 0 6.8p
L25 N049 N048 290n
R27 N050 N049 0.17
C25 N050 0 6.8p
L26 N051 N050 290n
R28 N052 N051 0.17
C26 N052 0 6.8p
L27 N053 N052 290n
R29 N054 N053 0.17
C27 N054 0 6.8p
L28 N055 N054 290n
R30 N056 N055 0.17
C28 N056 0 6.8p
L29 N057 N056 290n
R31 N058 N057 0.17
C29 N058 0 6.8p
L30 N059 N058 290n
R32 N060 N059 0.17
C30 N060 0 6.8p
L31 N061 N060 290n
R33 N062 N061 0.17
C31 N062 0 6.8p
L32 N063 N062 290n
R34 N064 N063 0.17
C32 N064 0 6.8p
L33 N065 N064 290n
R35 N066 N065 0.17
C33 N066 0 6.8p
L34 N067 N066 290n
R36 N068 N067 0.17
C34 N068 0 6.8p
L35 N069 N068 290n
R37 N070 N069 0.17
C35 N070 0 6.8p
L36 N071 N070 290n
R38 N072 N071 0.17
C36 N072 0 6.8p
L37 N073 N072 290n
R39 N074 N073 0.17
C37 N074 0 6.8p
L38 N075 N074 290n
R40 N076 N075 0.17
C38 N076 0 6.8p
L39 N077 N076 290n
R41 N078 N077 0.17
C39 N078 0 6.8p
L40 N079 N078 290n
R42 N080 N079 0.17
C40 N080 0 6.8p
L41 N081 N080 290n
R43 N082 N081 0.17
C41 N082 0 6.8p
L42 N083 N082 290n
R44 N084 N083 0.17
C42 N084 0 6.8p
L43 N085 N084 290n
R45 N086 N085 0.17
C43 N086 0 6.8p
L44 N087 N086 290n
R46 N088 N087 0.17
C44 N088 0 6.8p
L45 N089 N088 290n
R47 N090 N089 0.17
C45 N090 0 6.8p
L46 N091 N090 290n
R48 N092 N091 0.17
C46 N092 0 6.8p
L47 N093 N092 290n
R49 N094 N093 0.17
C47 N094 0 6.8p
L48 N095 N094 290n
R50 N096 N095 0.17
C48 N096 0 6.8p
L49 N097 N096 290n
R51 N098 N097 0.17
C49 N098 0 6.8p
L50 N099 N098 290n
R52 N100 N099 0.17
C50 N100 0 6.8p
L51 N101 N100 290n
R53 N102 N101 0.17
C51 N102 0 6.8p
L52 N103 N102 290n
R54 N104 N103 0.17
C52 N104 0 6.8p
L53 N105 N104 290n
R55 N106 N105 0.17
C53 N106 0 6.8p
L54 N107 N106 290n
R56 N108 N107 0.17
C54 N108 0 6.8p
L55 N109 N108 290n
R57 N110 N109 0.17
C55 N110 0 6.8p
L56 N111 N110 290n
R58 N112 N111 0.17
C56 N112 0 6.8p
L57 N113 N112 290n
R59 N114 N113 0.17
C57 N114 0 6.8p
L58 N115 N114 290n
R60 N116 N115 0.17
C58 N116 0 6.8p
L59 N117 N116 290n
R61 N118 N117 0.17
C59 N118 0 6.8p
L60 N119 N118 290n
R62 N120 N119 0.17
C60 N120 0 6.8p
L61 N121 N120 290n
R63 N122 N121 0.17
C61 N122 0 6.8p
L62 N123 N122 290n
R64 N124 N123 0.17
C62 N124 0 6.8p
L63 N125 N124 290n
R65 N126 N125 0.17
C63 N126 0 6.8p
L64 N127 N126 290n
R66 OUT N127 0.17
C64 OUT 0 6.8p
R67 OUT 0 220
R68 OUT 0 1E6
C65 OUT 0 25p
V1 N030 0 PULSE(0 1 0 7.5n 7.5n 100n 1 1)
* 16th cell
.tran 300n
.backanno
.end